# Altium schematic sheet 2016_AdvBeacon.SchDoc
size A3
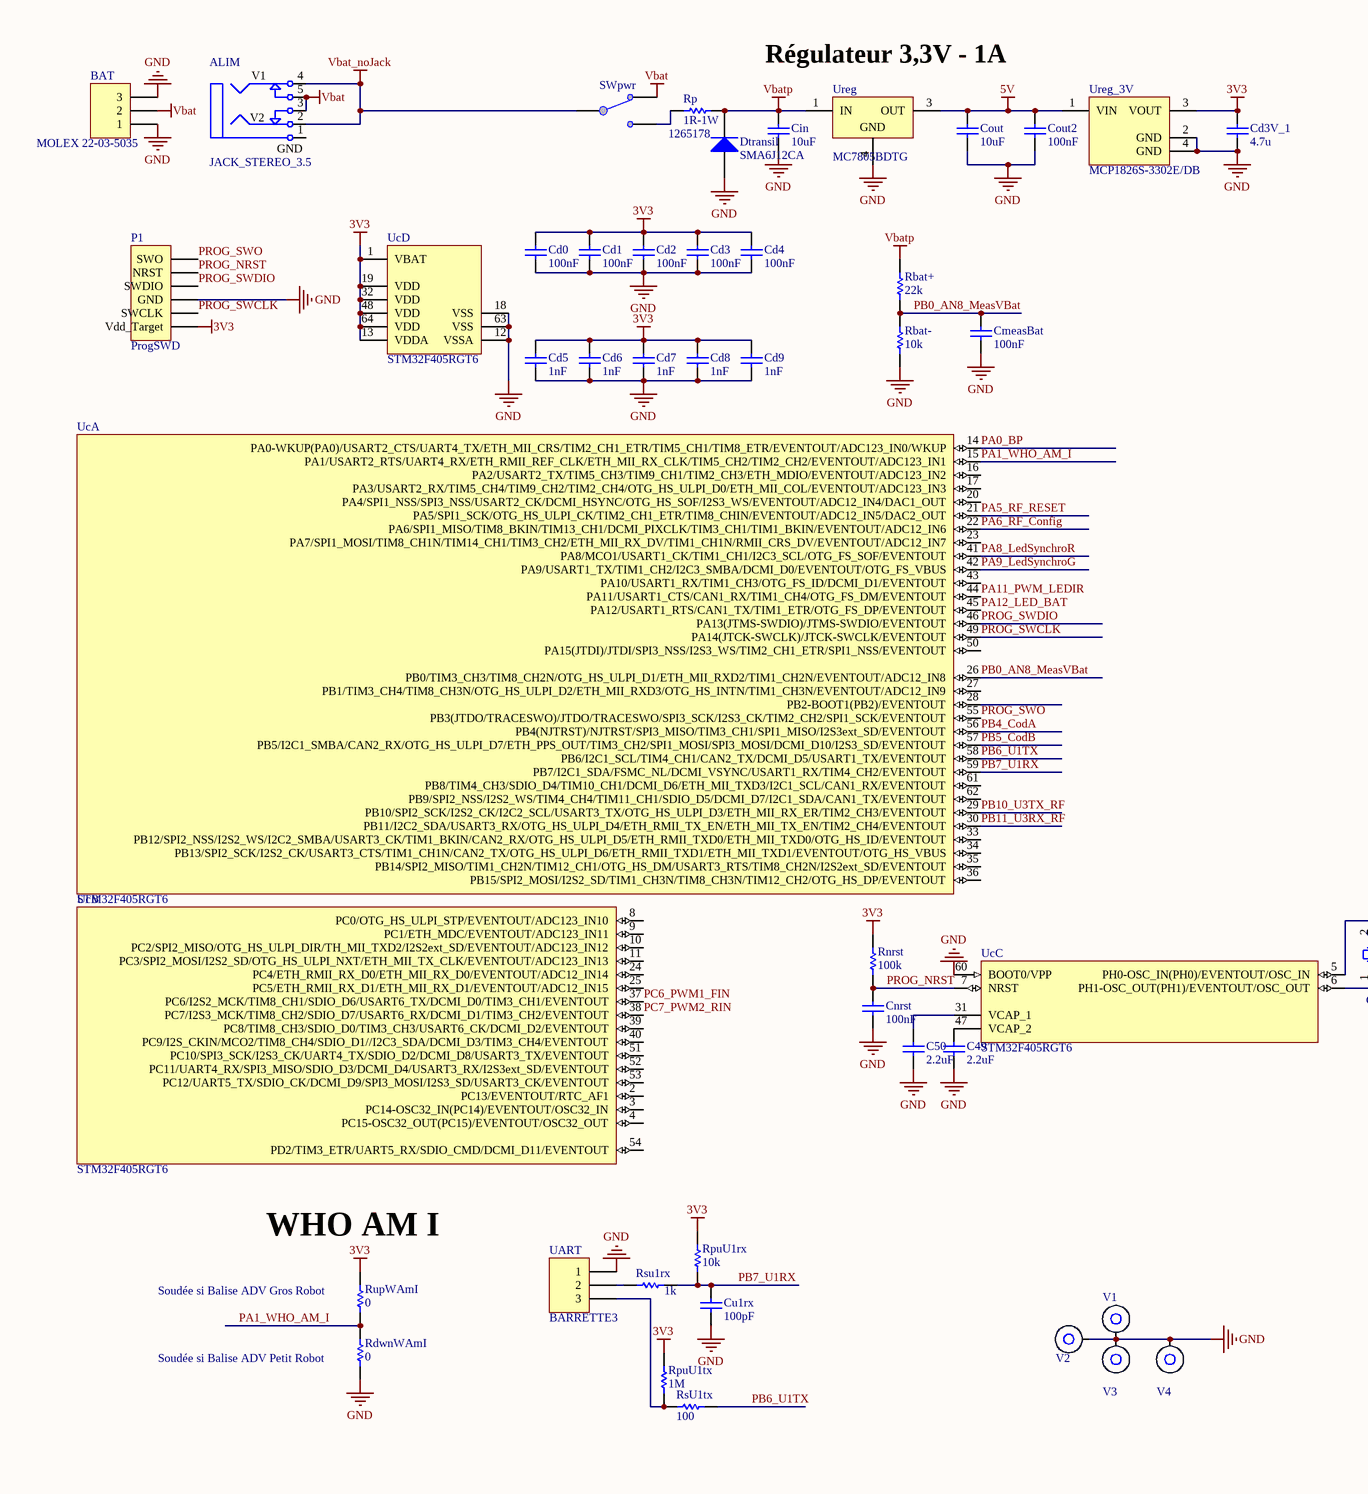
[diagram p0: 2016_AdvBeacon.SchDoc, left]
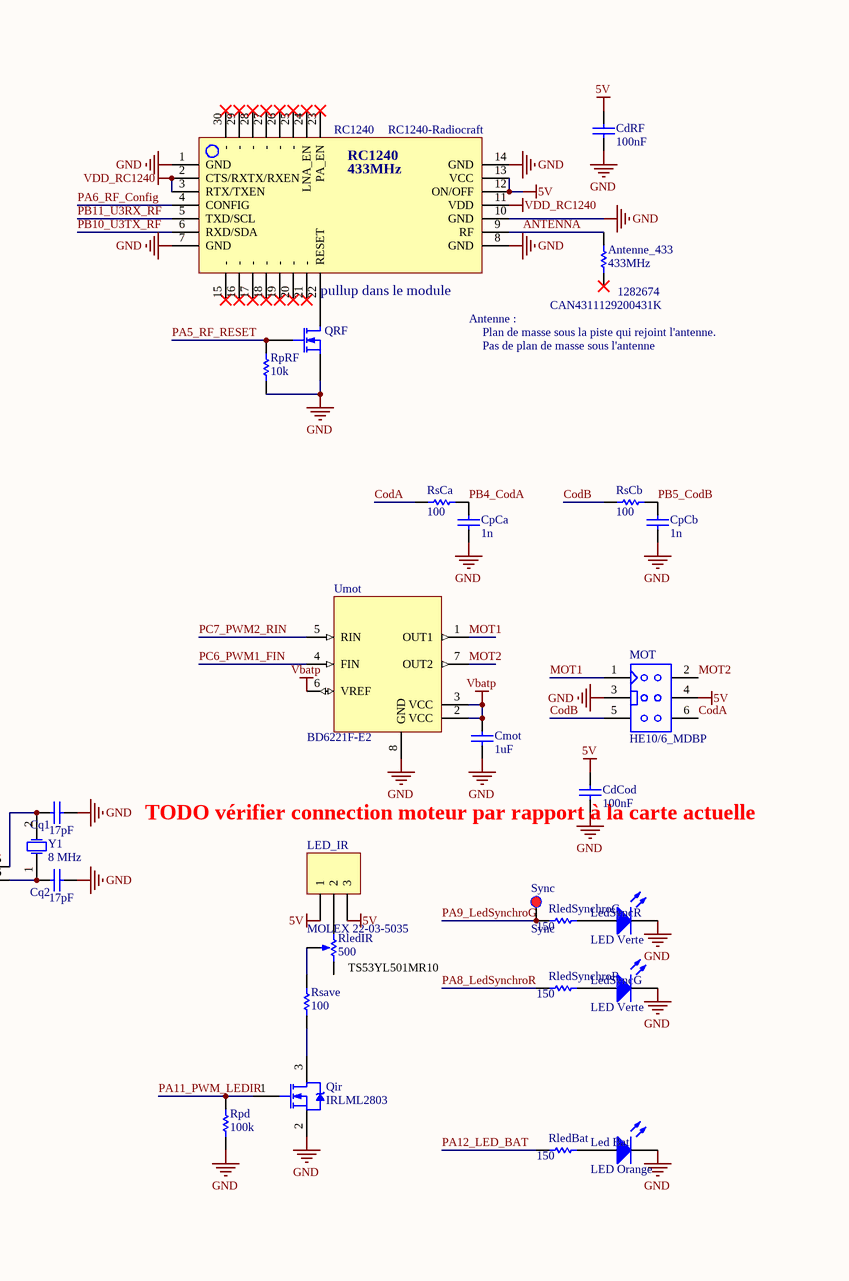
[diagram p1: 2016_AdvBeacon.SchDoc, middle]
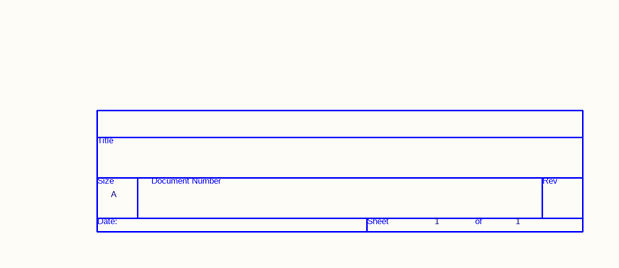
[diagram p2: 2016_AdvBeacon.SchDoc, right]

## Parts
*  Page Count: 1  Page Size: A  (hidden comment: TitleBlock0)  (graphical)
ALIM  Type: JACK_STEREO_3.5  [EMBASE_JACK_STEREO_3.5 mm]  (hidden comment: EMBASE_JACK_STEREO_3.5mm)
Antenne_433  433MHz  FAR: 1282674  [R1206_N]
BAT  MOLEX 22-03-5035  [MOLEX3_2.5MM]
C49  2.2uF  [C0805_N]
C50  2.2uF  [C0805_N]
Cd0  100nF  [C0805_N]
Cd1  100nF  [C0805_N]
Cd2  100nF  [C0805_N]
Cd3  100nF  [C0805_N]
Cd3V_1  4.7u  [C0805_N]
Cd4  100nF  [C0805_N]
Cd5  1nF  [C0805_N]
Cd6  1nF  [C0805_N]
Cd7  1nF  [C0805_N]
Cd8  1nF  [C0805_N]
Cd9  1nF  [C0805_N]
CdCod  100nF  [C0805_N]
CdRF  100nF  [C0805_N]
Cin  10uF  [C1206_N]
CmeasBat  100nF  [C0805_N]
Cmot  1uF  [C1206_N]
Cnrst  100nF  [C0805_N]
Cout  10uF  [C1206_N]
Cout2  100nF  [C0805_N]
CpCa  1n  [C0805_N]
CpCb  1n  [C0805_N]
Cq1  17pF  [C0805_N]
Cq2  17pF  [C0805_N]
Cu1rx  100pF  [C0805_N]
Dtransil  SMA6J12CA  [DO214AC]
Led_Bat  LED Orange  [LED_sideView_1204]
LED_IR  MOLEX 22-03-5035  [MOLEX3_2.5MM]
LedSyncG  LED Verte  [LED_sideView_1204]
LedSyncR  LED Verte  [LED_sideView_1204]
MOT  Type: HE10/6_MDBP  [HE10/6_M_D_BP]  (hidden comment: HE10/6_MALE_DROIT_BAS PROFIL)
P1  ProgSWD  [HDR1X6]
Qir  IRLML2803  [SOT23_N]
QRF  Transistor MOSFET-N  [SOT23-3N]  (value not drawn)
Rbat+  22k  [R1206_N]
Rbat-  10k  [R1206_N]
RC1240  RC1240-Radiocraft  [RC1240]
RdwnWAmI  0  [R1206_N]
RledBat  150  [R1206_N]
RledIR  500  [TRIMMER_CMS_TS53YL]
RledSynchroG  150  [R1206_N]
RledSynchroR  150  [R1206_N]
Rnrst  100k  [R1206_N]
Rp  1R-1W  FAR: 1265178  [INDUCTANCE_CMS_1812]
Rpd  100k  [R1206_N]
RpRF  10k  [R1206_N]
RpuU1rx  10k  [R1206_N]
RpuU1tx  1M  [R1206_N]
Rsave  100  [R1206_N]
RsCa  100  [R1206_N]
RsCb  100  [R1206_N]
Rsu1rx  1k  [R1206_N]
RsU1tx  100  [R1206_N]
RupWAmI  0  [R1206_N]
SWpwr  SW SPDT- APEM Série 523x  [SW_UNIPOL_DROIT - Ebay - SPDT - 11x6x5]  (value not drawn)
Sync  Sync  [Point Test_D0.9_P0.5mm]
UART  BARRETTE3  [HDR1X3]
Uc  STM32F405RGT6  [TQFP64_V]  (parts A,B,C,D of 4)
Umot  BD6221F-E2  [SO8_N]
Ureg  MC7805BDTG  [369A-13]
Ureg_3V  MCP1826S-3302E/DB  [SOT223-4N]
V1  Entretoise WURTH CMS  [ENTRETOISE_CMS_DOUBLE]  (value not drawn)
V2  Entretoise WURTH CMS  [ENTRETOISE_CMS_DOUBLE]  (value not drawn)
V3  Entretoise WURTH CMS  [ENTRETOISE_CMS_DOUBLE]  (value not drawn)
V4  Entretoise WURTH CMS  [ENTRETOISE_CMS_DOUBLE]  (value not drawn)
Y1  8 MHz  [HC49/4H_SMX]

## Nets
3V3: Cd0.2 Cd1.2 Cd2.2 Cd3.2 Cd3V_1.2 Cd4.2 Cd5.2 Cd6.2 Cd7.2 Cd8.2 Cd9.2 P1.1(Vdd_Target) Rnrst.2 RpuU1rx.2 RpuU1tx.2 RupWAmI.2 Uc.1(VBAT) Uc.13(VDDA) Uc.19(VDD) Uc.32(VDD) Uc.48(VDD) Uc.64(VDD) Ureg_3V.3(VOUT)
5V: CdCod.2 CdRF.2 Cout.2 Cout2.2 LED_IR.1 LED_IR.3 MOT.4 RC1240.12(ON/OFF) RC1240.13(VCC) Ureg.3(OUT) Ureg_3V.1(VIN)
GND: BAT.1 BAT.3 C49.1 C50.1 Cd0.1 Cd1.1 Cd2.1 Cd3.1 Cd3V_1.1 Cd4.1 Cd5.1 Cd6.1 Cd7.1 Cd8.1 Cd9.1 CdCod.1 CdRF.1 Cin.1 CmeasBat.1 Cmot.1 Cnrst.1 Cout.1 Cout2.1 CpCa.2 CpCb.2 Cq1.1 Cq2.1 Cu1rx.1 Dtransil.1(A) Led_Bat.2(K) LedSyncG.2(K) LedSyncR.2(K) MOT.3 P1.3(GND) Qir.2(S) QRF.2(S) Rbat-.2 RC1240.1(GND) RC1240.7(GND) RC1240.8(GND) RC1240.10(GND) RC1240.14(GND) RdwnWAmI.1 Rpd.1 RpRF.2 UART.1 Uc.12(VSSA) Uc.18(VSS) Uc.60(BOOT0/VPP) Uc.63(VSS) Umot.8(GND) Ureg.4(GND) Ureg_3V.2(GND) Ureg_3V.4(GND) V1.1 V2.1 V3.1 V4.1
Vbat: ALIM.3 ALIM.5 BAT.2 SWpwr.NC1
Vbat_noJack: ALIM.2 ALIM.4 SWpwr.COMMON1
Vbatp: Cin.2 Cmot.2 Dtransil.2(K) Rbat+.1 Rp.2 Umot.2(VCC) Umot.3(VCC) Umot.6(VREF) Ureg.1(IN)
VDD_RC1240: RC1240.2(CTS/RXTX/RXEN) RC1240.3(RTX/TXEN) RC1240.11(VDD)
ANTENNA: Antenne_433.1 RC1240.9(RF)
CodA: MOT.6 RsCa.2
CodB: MOT.5 RsCb.2
MOT1: MOT.1 Umot.1(OUT1)
MOT2: MOT.2 Umot.7(OUT2)
PA0_BP: Uc.14(PA0-WKUP(PA0)/USART2_CTS/UART4_TX/ETH_MII_CRS/TIM2_CH1_ETR/TIM5_CH1/TIM8_ETR/EVENTOUT/ADC123_IN0/WKUP)
PA1_WHO_AM_I: RdwnWAmI.2 RupWAmI.1 Uc.15(PA1/USART2_RTS/UART4_RX/ETH_RMII_REF_CLK/ETH_MII_RX_CLK/TIM5_CH2/TIM2_CH2/EVENTOUT/ADC123_IN1)
PA5_RF_RESET: QRF.1(G) RpRF.1 Uc.21(PA5/SPI1_SCK/OTG_HS_ULPI_CK/TIM2_CH1_ETR/TIM8_CHIN/EVENTOUT/ADC12_IN5/DAC2_OUT)
PA6_RF_Config: RC1240.4(CONFIG) Uc.22(PA6/SPI1_MISO/TIM8_BKIN/TIM13_CH1/DCMI_PIXCLK/TIM3_CH1/TIM1_BKIN/EVENTOUT/ADC12_IN6)
PA8_LedSynchroR: RledSynchroR.2 Uc.41(PA8/MCO1/USART1_CK/TIM1_CH1/I2C3_SCL/OTG_FS_SOF/EVENTOUT)
PA9_LedSynchroG: RledSynchroG.2 Sync.1 Uc.42(PA9/USART1_TX/TIM1_CH2/I2C3_SMBA/DCMI_D0/EVENTOUT/OTG_FS_VBUS)
PA11_PWM_LEDIR: Qir.1(G) Rpd.2 Uc.44(PA11/USART1_CTS/CAN1_RX/TIM1_CH4/OTG_FS_DM/EVENTOUT)
PA12_LED_BAT: RledBat.2 Uc.45(PA12/USART1_RTS/CAN1_TX/TIM1_ETR/OTG_FS_DP/EVENTOUT)
PB0_AN8_MeasVBat: CmeasBat.2 Rbat+.2 Rbat-.1 Uc.26(PB0/TIM3_CH3/TIM8_CH2N/OTG_HS_ULPI_D1/ETH_MII_RXD2/TIM1_CH2N/EVENTOUT/ADC12_IN8)
PB4_CodA: CpCa.1 RsCa.1 Uc.56(PB4(NJTRST)/NJTRST/SPI3_MISO/TIM3_CH1/SPI1_MISO/I2S3ext_SD/EVENTOUT)
PB5_CodB: CpCb.1 RsCb.1 Uc.57(PB5/I2C1_SMBA/CAN2_RX/OTG_HS_ULPI_D7/ETH_PPS_OUT/TIM3_CH2/SPI1_MOSI/SPI3_MOSI/DCMI_D10/I2S3_SD/EVENTOUT)
PB6_U1TX: RsU1tx.2 Uc.58(PB6/I2C1_SCL/TIM4_CH1/CAN2_TX/DCMI_D5/USART1_TX/EVENTOUT)
PB7_U1RX: Cu1rx.2 RpuU1rx.1 Rsu1rx.1 Uc.59(PB7/I2C1_SDA/FSMC_NL/DCMI_VSYNC/USART1_RX/TIM4_CH2/EVENTOUT)
PB10_U3TX_RF: RC1240.6(RXD/SDA) Uc.29(PB10/SPI2_SCK/I2S2_CK/I2C2_SCL/USART3_TX/OTG_HS_ULPI_D3/ETH_MII_RX_ER/TIM2_CH3/EVENTOUT)
PB11_U3RX_RF: RC1240.5(TXD/SCL) Uc.30(PB11/I2C2_SDA/USART3_RX/OTG_HS_ULPI_D4/ETH_RMII_TX_EN/ETH_MII_TX_EN/TIM2_CH4/EVENTOUT)
PC6_PWM1_FIN: Uc.37(PC6/I2S2_MCK/TIM8_CH1/SDIO_D6/USART6_TX/DCMI_D0/TIM3_CH1/EVENTOUT) Umot.4(FIN)
PC7_PWM2_RIN: Uc.38(PC7/I2S3_MCK/TIM8_CH2/SDIO_D7/USART6_RX/DCMI_D1/TIM3_CH2/EVENTOUT) Umot.5(RIN)
PROG_NRST: Cnrst.2 P1.5(NRST) Rnrst.1 Uc.7(NRST)
PROG_SWCLK: P1.2(SWCLK) Uc.49(PA14(JTCK-SWCLK)/JTCK-SWCLK/EVENTOUT)
PROG_SWDIO: P1.4(SWDIO) Uc.46(PA13(JTMS-SWDIO)/JTMS-SWDIO/EVENTOUT)
PROG_SWO: P1.6(SWO) Uc.55(PB3(JTDO/TRACESWO)/JTDO/TRACESWO/SPI3_SCK/I2S3_CK/TIM2_CH2/SPI1_SCK/EVENTOUT)
NetC49_2: C49.2 Uc.47(VCAP_2)
NetC50_2: C50.2 Uc.31(VCAP_1)
NetCq1_2: Cq1.2 Uc.5(PH0-OSC_IN(PH0)/EVENTOUT/OSC_IN) Y1.2(OSC2)
NetCq2_2: Cq2.2 Uc.6(PH1-OSC_OUT(PH1)/EVENTOUT/OSC_OUT) Y1.1(OSC1)
NetLed_Bat_1: Led_Bat.1(A) RledBat.1
NetLED_IR_2: LED_IR.2 RledIR.1(TOP)
NetLedSyncG_1: LedSyncG.1(A) RledSynchroR.1
NetLedSyncR_1: LedSyncR.1(A) RledSynchroG.1
NetQir_3: Qir.3(D) Rsave.1
NetQRF_3: QRF.3(D) RC1240.22(RESET)
NetRledIR_2: RledIR.2(TAP) Rsave.2
NetRp_1: Rp.1 SWpwr.NO1
NetRpuU1tx_1: RpuU1tx.1 RsU1tx.1 UART.3
NetRsu1rx_2: Rsu1rx.2 UART.2

Not connected (* = marked no-connect by the designer): ALIM 1; Antenne_433 2*; RC1240 15(-)* 16(-)* 17(-)* 18(-)* 19(-)* 20(-)* 21(-)* 23(PA_EN)* 24(LNA_EN)* 25(-)* 26(-)* 27(-)* 28(-)* 29(-)* 30(-)*; RledIR 3(BOT); Uc 2(PC13/EVENTOUT/RTC_AF1) 3(PC14-OSC32_IN(PC14)/EVENTOUT/OSC32_IN) 4(PC15-OSC32_OUT(PC15)/EVENTOUT/OSC32_OUT) 8(PC0/OTG_HS_ULPI_STP/EVENTOUT/ADC123_IN10) 9(PC1/ETH_MDC/EVENTOUT/ADC123_IN11) 10(PC2/SPI2_MISO/OTG_HS_ULPI_DIR/TH_MII_TXD2/I2S2ext_SD/EVENTOUT/ADC123_IN12) 11(PC3/SPI2_MOSI/I2S2_SD/OTG_HS_ULPI_NXT/ETH_MII_TX_CLK/EVENTOUT/ADC123_IN13) 16(PA2/USART2_TX/TIM5_CH3/TIM9_CH1/TIM2_CH3/ETH_MDIO/EVENTOUT/ADC123_IN2) 17(PA3/USART2_RX/TIM5_CH4/TIM9_CH2/TIM2_CH4/OTG_HS_ULPI_D0/ETH_MII_COL/EVENTOUT/ADC123_IN3) 20(PA4/SPI1_NSS/SPI3_NSS/USART2_CK/DCMI_HSYNC/OTG_HS_SOF/I2S3_WS/EVENTOUT/ADC12_IN4/DAC1_OUT) 23(PA7/SPI1_MOSI/TIM8_CH1N/TIM14_CH1/TIM3_CH2/ETH_MII_RX_DV/TIM1_CH1N/RMII_CRS_DV/EVENTOUT/ADC12_IN7) 24(PC4/ETH_RMII_RX_D0/ETH_MII_RX_D0/EVENTOUT/ADC12_IN14) 25(PC5/ETH_RMII_RX_D1/ETH_MII_RX_D1/EVENTOUT/ADC12_IN15) 27(PB1/TIM3_CH4/TIM8_CH3N/OTG_HS_ULPI_D2/ETH_MII_RXD3/OTG_HS_INTN/TIM1_CH3N/EVENTOUT/ADC12_IN9) 28(PB2-BOOT1(PB2)/EVENTOUT) 33(PB12/SPI2_NSS/I2S2_WS/I2C2_SMBA/USART3_CK/TIM1_BKIN/CAN2_RX/OTG_HS_ULPI_D5/ETH_RMII_TXD0/ETH_MII_TXD0/OTG_HS_ID/EVENTOUT) 34(PB13/SPI2_SCK/I2S2_CK/USART3_CTS/TIM1_CH1N/CAN2_TX/OTG_HS_ULPI_D6/ETH_RMII_TXD1/ETH_MII_TXD1/EVENTOUT/OTG_HS_VBUS) 35(PB14/SPI2_MISO/TIM1_CH2N/TIM12_CH1/OTG_HS_DM/USART3_RTS/TIM8_CH2N/I2S2ext_SD/EVENTOUT) 36(PB15/SPI2_MOSI/I2S2_SD/TIM1_CH3N/TIM8_CH3N/TIM12_CH2/OTG_HS_DP/EVENTOUT) 39(PC8/TIM8_CH3/SDIO_D0/TIM3_CH3/USART6_CK/DCMI_D2/EVENTOUT) 40(PC9/I2S_CKIN/MCO2/TIM8_CH4/SDIO_D1//I2C3_SDA/DCMI_D3/TIM3_CH4/EVENTOUT) 43(PA10/USART1_RX/TIM1_CH3/OTG_FS_ID/DCMI_D1/EVENTOUT) 50(PA15(JTDI)/JTDI/SPI3_NSS/I2S3_WS/TIM2_CH1_ETR/SPI1_NSS/EVENTOUT) 51(PC10/SPI3_SCK/I2S3_CK/UART4_TX/SDIO_D2/DCMI_D8/USART3_TX/EVENTOUT) 52(PC11/UART4_RX/SPI3_MISO/SDIO_D3/DCMI_D4/USART3_RX/I2S3ext_SD/EVENTOUT) 53(PC12/UART5_TX/SDIO_CK/DCMI_D9/SPI3_MOSI/I2S3_SD/USART3_CK/EVENTOUT) 54(PD2/TIM3_ETR/UART5_RX/SDIO_CMD/DCMI_D11/EVENTOUT) 61(PB8/TIM4_CH3/SDIO_D4/TIM10_CH1/DCMI_D6/ETH_MII_TXD3/I2C1_SCL/CAN1_RX/EVENTOUT) 62(PB9/SPI2_NSS/I2S2_WS/TIM4_CH4/TIM11_CH1/SDIO_D5/DCMI_D7/I2C1_SDA/CAN1_TX/EVENTOUT)

## Notes on the sheet
- Régulateur 3,3V - 1A
- (near RC1240) pullup dans le module
- (near RC1240) Antenne :
- Plan de masse sous la piste qui rejoint l'antenne.
- Pas de plan de masse sous l'antenne
- (near CdCod) TODO vérifier connection moteur par rapport à la carte actuelle
- (near RledIR) TS53YL501MR10
- (near RupWAmI) Soudée si Balise ADV Gros Robot
- (near RupWAmI) WHO AM I
- (near RdwnWAmI) Soudée si Balise ADV Petit Robot
- Title
- Size:
- Date:
- A3
- Number:
- Time:
- Revision:
- Sheet
- of
- File:
- (in symbol EMBASE_JACK_STEREO_3.5mm) V1; V2; GND
- (in symbol RC1240-Radiocraft) 433MHz
- (in symbol TitleBlock0) Title; Size; Document Number; Rev; Date:; Sheet; of

## Library data of the parts
ALIM = EMBASE_JACK_STEREO_3.5mm: EMBASE JACK STEREO 3.5mm
Antenne_433 = Resistor: CAN4311129200431K; Published: 8-Jun-2000; LatestRevisionDate: 17-Jul-2002; LatestRevisionNote: Re-released for DXP Platform.; PackageReference: CAN4311129200431K; Publisher: Altium Limited
BAT LED_IR UART = BARRETTE3: Header, 3-Pin; LatestRevisionDate: 17-Jul-2002; LatestRevisionNote: Re-released for DXP Platform.; Publisher: Altium Limited
C49 C50 Cd0-Cd9 Cmot Cnrst CpCa CpCb Cq1 Cq2 Cu1rx = Condensateur: Capacitor; Published: 8-Jun-2000; LatestRevisionDate: 17-Jul-2002; LatestRevisionNote: Re-released for DXP Platform.; PackageReference: RAD-0.3; Publisher: Altium Limited
Cd3V_1 CdCod CdRF Cin CmeasBat Cout Cout2 = Capacitor: Published: 8-Jun-2000; LatestRevisionDate: 17-Jul-2002; LatestRevisionNote: Re-released for DXP Platform.; PackageReference: RAD-0.3; Publisher: Altium Limited
Dtransil = Diode 1N4001: 1 Amp General Purpose Rectifier; Published: 8-Jun-2000; LatestRevisionDate: 17-Jul-2002; LatestRevisionNote: Re-released for DXP Platform.; DatasheetVersion: 1998; PackageVersion: Aug-1999; PackageReference: DO-41; Publisher: Altium Limited; Code_JEDEC: DO-204-AL; ComponentLink1Description: Manufacturer Link; ComponentLink1URL: http://www.fairchildsemi.com/; ComponentLink2Description: Datasheet; ComponentLink2URL: http://www.fairchildsemi.com/ds/1N%2F1N4001.pdf
Led_Bat LedSyncG LedSyncR = LED: Typical LED; Published: 8-Jun-2000; LatestRevisionDate: 08-Jul-2005; LatestRevisionNote: Mech Layer 1 removed.; PackageReference: LED-1; Publisher: Altium Limited
MOT = HE10/6_MALE_DROIT_BAS PROFIL: EMBASE HE10/6 MALE DROIT BAS PROFIL
P1 = Header 6: Header, 6-Pin; LatestRevisionDate: 17-Jul-2002; LatestRevisionNote: Re-released for DXP Platform.; Publisher: Altium Limited
Qir = IRLML2803: HEXFET Power MOSFET; Published: 8-Jun-2000; LatestRevisionDate: 17-Jul-2002; LatestRevisionNote: Re-released for DXP Platform.; DatasheetVersion: Aug-1997; PackageReference: SOT-23; Publisher: Altium Limited; PackageDescription: SOT-23; 3 Leads; Body 3.1 x 2.5 mm, inc. leads (LxW max); ComponentLink1Description: Manufacturer Link; ComponentLink1URL: http://www.irf.com/; ComponentLink2Description: Datasheet; ComponentLink2URL: http://www.irf.com/product-info/datasheets/data/irlml2803.pdf
QRF = Transistor MOSFET-N: N-Channel MOSFET; PackageDocument: 1995/1996; Published: 8-Jun-2000; LatestRevisionDate: 17-Jul-2002; LatestRevisionNote: Re-released for DXP Platform.; PackageReference: E3; Publisher: Altium Limited
Rbat+ Rbat- RdwnWAmI RledBat RledSynchroG RledSynchroR Rnrst Rp Rpd RpRF RpuU1rx RpuU1tx Rsave RsCa RsCb Rsu1rx RsU1tx RupWAmI = Resistor: Published: 8-Jun-2000; LatestRevisionDate: 17-Jul-2002; LatestRevisionNote: Re-released for DXP Platform.; PackageReference: AXIAL-0.5; Publisher: Altium Limited
RC1240 = RC1240-Radiocraft: RC1240 - Radiocraft 433MHz Transceiver
RledIR = Trimmer monotour, Bourns,serie 3314P
SWpwr = SW SPDT- APEM Série 523x: Switch unipolaire a levier
Sync = Point Test: Publisher: Damien GUITTON
Uc = STM32F405RGT6: ARM Cortex-M4 32b MCU+FPU, 210DMIP, 1024 kB Flash, 192+4 kB RAM, 51 I/Os, 64-pin LQFP, -40 to +85°C, Tray; Internal RAM: 192kB; Operating Frequency (Processor Speed): 168MHz; A/D Converter: 16x12-bit; D/A Converter: 2x12-bit; 16-bit Timers (IC/OC/PWM): 12x16-bit(24/24/30); 32-bit Timer (IC/OC/PWM): 2x32-bit (8/8/8); Other Timer Functions: 2xWDG, RTC, 24-bit down counter; Serial Interface: 3xSPI/2xI2S/2xI2C/3xUSART(IrDa, ISO7816)/3xUART/1xUSB OTG FS/HS, 2xCAN/ SDIO; DatasheetVersion: rev2, Jan-2012; PackageVersion: 2012; PackageReference: TQFP64; PackageDescription: 64-Pin Low Profile Quad Flat Package, 10x10 mm Body, 0.5 mm Pitch; ComponentLink1Description: Manufacturer URL; ComponentLink1URL: http://www.st.com/; ComponentLink2Description: STM32F405/7 Datasheet; ComponentLink2URL: http://www.st.com/internet/com/TECHNICAL_RESOURCES/TECHNICAL_LITERATURE/DATASHEET/DM00037051.pdf; ComponentLink3Description: STM32F4 Web Page; ComponentLink3URL: http://www.st.com/internet/mcu/subclass/1521.jsp
Umot = BD6220F: H Bridge - 2A
Ureg = MC7805ACD2T: Three-Terminal Positive Voltage Regulator; Note: Pin 2 is electrically connected to Pin 4; Pin 2 is trimmed and not drawn;; Published: 15-Apr-2002; DatasheetVersion: 1997; PackageVersion: 1997; PackageReference: 936-03; Publisher: Altium Limited; PackageDescription: D2-PAK/TO-263-AB; 3 Leads (1 Cropped); Body 14.7 (inc. leads) x 10.2 mm (LxW max); ComponentLink1Description: Manufacturer Link; ComponentLink1URL: http://www.onsemi.com/site/products/taxonomy/0,4438,503,00.html; ComponentLink2Description: Datasheet; ComponentLink2URL: http://www.onsemi.com/pub/Collateral/MC7800-D.PDF
Ureg_3V = MCP1826S-3302E/DB: 1000 mA, Low Voltage, Low Quiescent Current LDO Regulator, 3-Pin SOT-223, Extended Temperature; FirstPublished: 29-Jan-2009; DatasheetVersion: revA, Aug-2007; PackageVersion: revBB, Aug-2009; PackageReference: SOT-223-DB3; Publisher: Altium Limited; PackageDescription: 3-Lead Plastic Small Outline Transistor (DB) [SOT-223]; Supplier 1: Digi-Key; Supplier Part Number 1: MCP1826S-3302E/DB-ND; Supplier 2: Farnell; Supplier Part Number 2: 1578424; Supplier 3: Newark; Supplier Part Number 3: 27M0037; ComponentLink1Description: Datasheet; ComponentLink1URL: http://ww1.microchip.com/downloads/en/DeviceDoc/22057a.pdf; ComponentLink2Description: Packaging Specification; ComponentLink2URL: http://www.microchip.com/stellent/groups/techpub_sg/documents/packagingspec/en012702.pdf; ComponentLink3Description: Microchip.com Home; ComponentLink3URL: http://www.microchip.com/
V1-V4 = Entretoise WURTH CMS: Entretoise Wurth; Publisher: Damien Guitton
Y1 = Quartz: Crystal Oscillator; Published: 8-Jun-2000; LatestRevisionDate: 17-Jul-2002; LatestRevisionNote: Re-released for DXP Platform.; PackageReference: R38; Publisher: Altium Limited
* = TitleBlock0: Page Number: 1; Page Create Date: March  8, 1995